# EAGLE design MQ_GasSensors_Board (EAGLE 8.2.1)
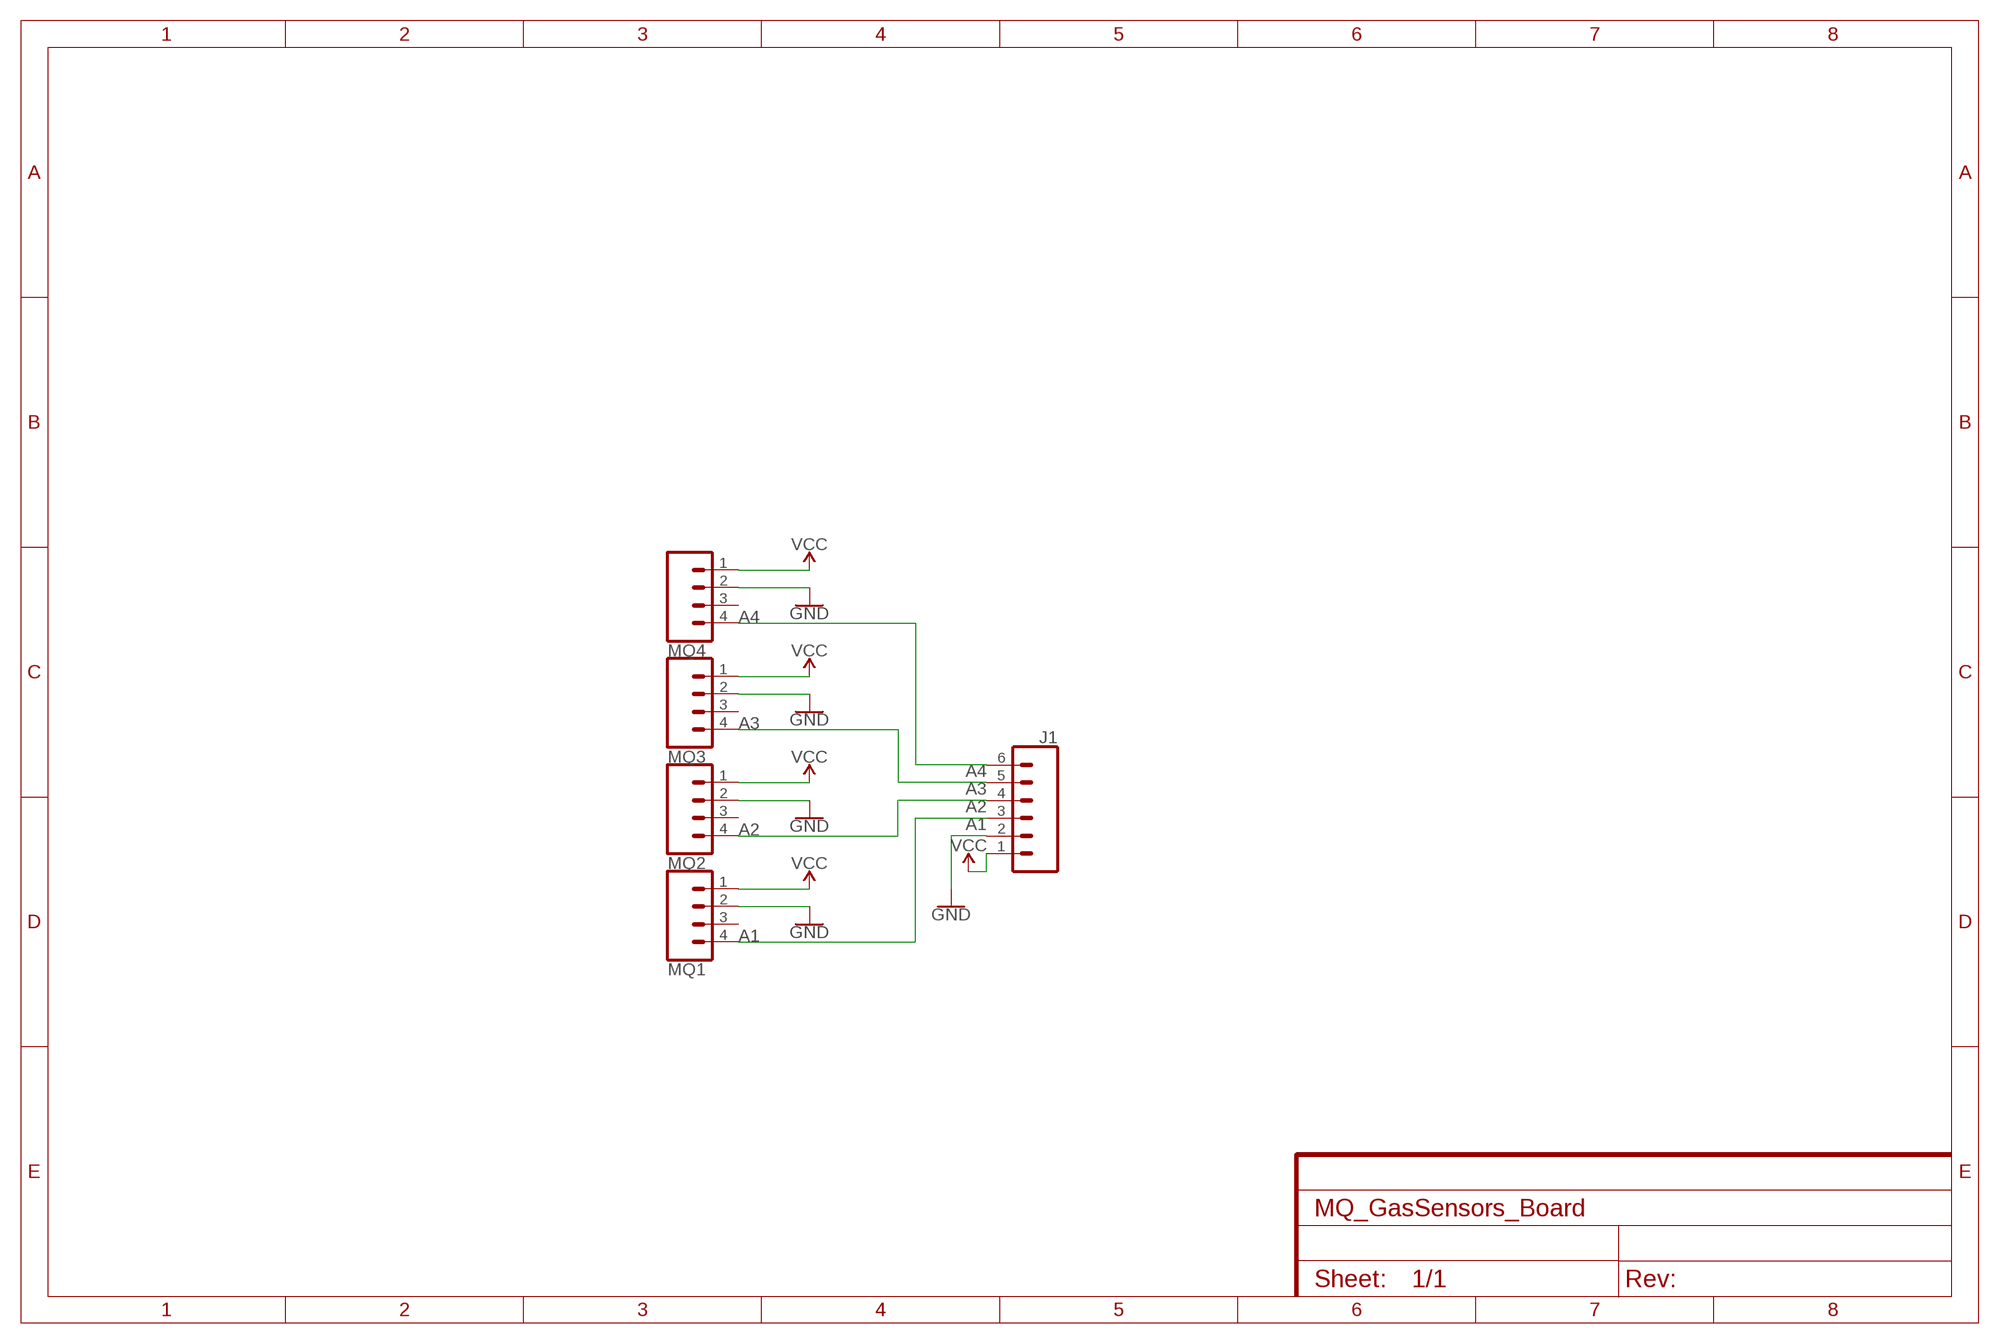
[diagram p0: schematic, sheet 1]

## Parts
J1  CONN_06SILK_FEMALE_PTH  [1X06]
MQ1  CONN_04  [1X04]
MQ2  CONN_04  [1X04]
MQ3  CONN_04  [1X04]
MQ4  CONN_04  [1X04]

## Nets
A1: J1.3 MQ1.4
A2: J1.4 MQ2.4
A3: J1.5 MQ3.4
A4: J1.6 MQ4.4
GND: J1.2 MQ1.2 MQ2.2 MQ3.2 MQ4.2
VCC: J1.1 MQ1.1 MQ2.1 MQ3.1 MQ4.1
Unconnected: MQ1.3 MQ2.3 MQ3.3 MQ4.3

## Library data of the parts
J1 = SparkFun-Connectors:CONN_06: Multi connection point. Often used as Generic Header-pin footprint for 0.1 inch spaced/style header connections On any of the 0.1 inch spaced packages, you can populate with these: Break Away Headers - Straight <https://www.sparkfun.com/products/116> (PRT-00116) Break Away Male Headers - Right Angle <https://www.sparkfun.com/products/553> (PRT-00553) Female Headers <https://www.sparkfun.com/products/115> (PRT-00115) Break Away Headers - Machine Pin <https://www.sparkfun.com/products/117> (PRT-00117) Break Away Female Headers - Swiss Machine Pin <https://www.sparkfun.com/products/743> (PRT-00743) Arduino Stackable Header - 6 Pin <https://www.sparkfun.com/products/9280> (PRT-09280) For SCREWTERMINALS and SPRING TERMINALS visit here: Screw Terimnals on SparkFun.com <https://www.sparkfun.com/search/results?term=Screw+Terminals> (5mm/3.5mm/2.54mm spacing) This device is also useful as a general connection point to wire up your design to another part of your project. Our various solder wires solder well into these plated through hole pads. Hook-Up Wire - Assortment (Stranded, 22 AWG) <https://www.sparkfun.com/products/11375> (PRT-11375) Hook-Up Wire - Assortment (Solid Core, 22 AWG) <https://www.sparkfun.com/products/11367> (PRT-11367) View the entire wire category on our website here <https://www.sparkfun.com/categories/141>; PROD_ID: CONN-08437
MQ1-MQ4 = SparkFun-Connectors:CONN_04: Multi connection point. Often used as Generic Header-pin footprint for 0.1 inch spaced/style header connections On any of the 0.1 inch spaced packages, you can populate with these: Break Away Headers - Straight <https://www.sparkfun.com/products/116> (PRT-00116) Break Away Male Headers - Right Angle <https://www.sparkfun.com/products/553> (PRT-00553) Female Headers <https://www.sparkfun.com/products/115> (PRT-00115) Break Away Headers - Machine Pin <https://www.sparkfun.com/products/117> (PRT-00117) Break Away Female Headers - Swiss Machine Pin <https://www.sparkfun.com/products/743> (PRT-00743) For SCREWTERMINALS and SPRING TERMINALS visit here: Screw Terimnals on SparkFun.com <https://www.sparkfun.com/search/results?term=Screw+Terminals> (5mm/3.5mm/2.54mm spacing) This device is also useful as a general connection point to wire up your design to another part of your project. Our various solder wires solder well into these plated through hole pads. Hook-Up Wire - Assortment (Stranded, 22 AWG) <https://www.sparkfun.com/products/11375> (PRT-11375) Hook-Up Wire - Assortment (Solid Core, 22 AWG) <https://www.sparkfun.com/products/11367> (PRT-11367) View the entire wire category on our website here <https://www.sparkfun.com/categories/141> Special notes: Molex polarized connector foot print use with SKU : PRT-08231 with associated crimp pins and housings. 1MM SMD Version SKU: PRT-10208; PROD_ID: CONN-09696

## Board
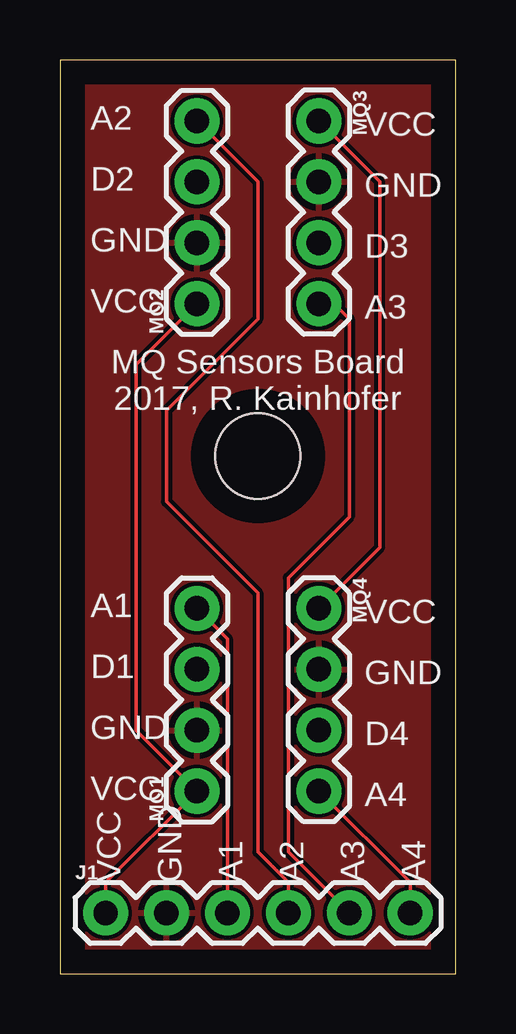
[diagram p1: board, top side]
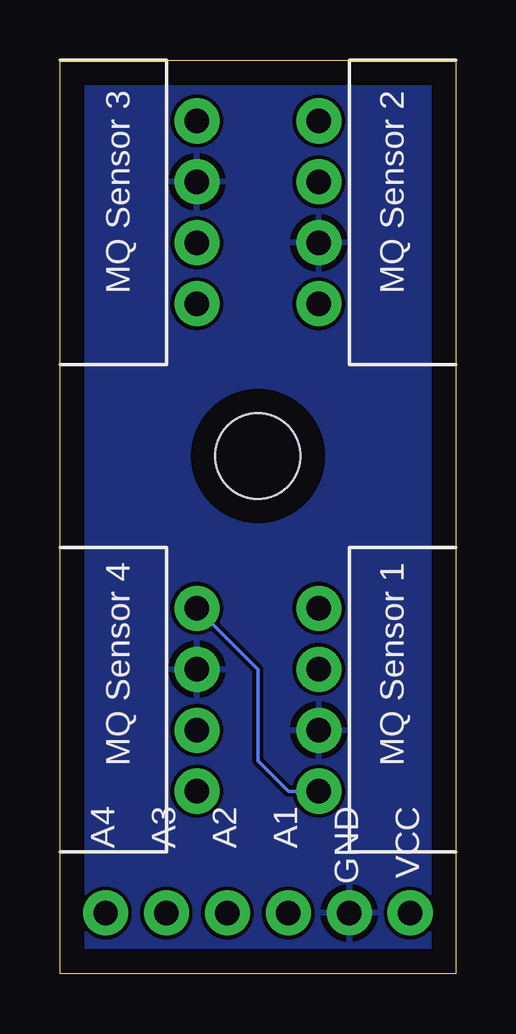
[diagram p2: board, bottom side, seen from below]

Size 16.51 x 38.1 mm. Coordinates in mm from the lower left corner, seen from the top.
Outline: 0,0 16.51,0 16.51,38.1 0,38.09 0,0
Copper layers (1*16): Top 0.035mm / dielectric 1.5mm / Bottom 0.035mm
Design rules "default": minimum track width 6mil, minimum drill 0.35mm, track to track 6mil, track to pad 6mil, pad to pad 6mil, via to via 6mil, smd to smd 6mil, copper to edge 40mil, drill to drill 6mil, minimum pad ring 10mil, minimum via ring 8mil, stop-mask expansion 4mil, vias tented up to drill 0mil, thermal gap 10mil
Holes 3.56 mm at 8.26,21.59

### Footprints (pad centres in the part's own frame; a part is rotated, then mirrored left to right if it is on the bottom)
1X06 = drill 1.016 pad 1.88: 1 0,0; 2 2.54,0; 3 5.08,0; 4 7.62,0; 5 10.16,0; 6 12.7,0
1X04 = drill 1.016 pad 1.88: 1 0,0; 2 2.54,0; 3 5.08,0; 4 7.62,0

### Placement (x,y rotation side)
J1  1.91,2.54 0 top
MQ1  5.71,7.62 90 top
MQ2  5.71,27.94 90 top
MQ3  10.79,35.56 270 top
MQ4  10.79,15.24 270 top

### Tracks (layer width: path | path; a pad name or v marks a point on that pad's centre or on a via)
A1
  Top 0.152: MQ1.4 6.99,13.97 J1.3
A2
  Top 0.152: J1.4 9.53,3.81 8.26,5.08 8.26,15.88 4.44,19.68 4.44,23.5 8.26,27.31 8.26,33.02 MQ2.4
A3
  Top 0.152: J1.5 9.53,5.08 9.53,16.51 12.07,19.05 12.07,27.31 11.43,27.94 MQ3.4
A4
  Top 0.152: J1.6 14.61,3.81 MQ4.4
GND
  pour Top: 0,38.1 16.51,38.1 16.51,0 0,0
  pour Bottom: 0,38.1 16.51,38.1 16.51,0 0,0
VCC
  Top 0.152: J1.1 1.91,3.81 MQ1.1 3.17,10.16 3.17,25.4 MQ2.1 | MQ4.1 13.34,17.78 13.34,33.02 MQ3.1
  Bottom 0.152: MQ1.1 6.99,7.62 8.26,8.89 8.26,12.7 MQ4.1

### Text on the board
tPlace: A2 / D2 / GND / VCC | VCC / GND / D3 / A3 | MQ Sensors Board / 2017, R. Kainhofer | A1 / D1 / GND / VCC | VCC / GND / D4 / A4 | VCC / GND / A1 / A2 / A3 / A4
bPlace: MQ Sensor 2 | MQ Sensor 3 | MQ Sensor 1 | MQ Sensor 4 | A4 / A3 / A2 / A1 / GND / VCC